# Altium schematic sheet RS232.SchDoc
size A; SheetNumber: 4; SheetTotal: 7
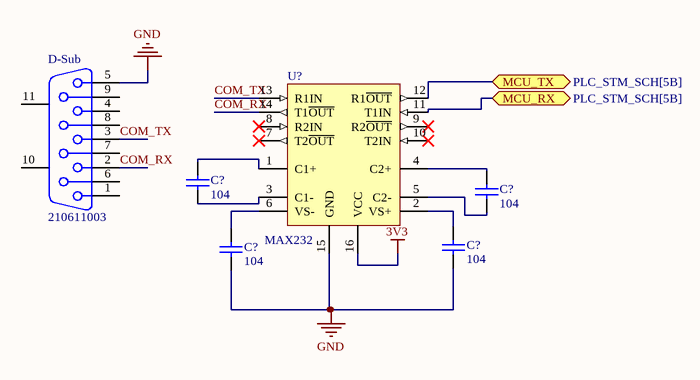
[diagram p0: RS232.SchDoc]

## Parts
(Parts that share a designator on the sheet are numbered #1, #2 ... from top to bottom, then left to right.)
C?#1  104  [tu 0805]
C?#2  104  [tu 0805]
C?#3  104  [tu 0805]
C?#4  104  [tu 0805]
D-Sub  210611003  [COM9B]
U?  MAX232  [SO16]

## Ports
MCU_RX (bidir, see PLC_STM_SCH[5B]), MCU_TX (bidir, see PLC_STM_SCH[5B])

## Nets
3V3: U?.16(VCC)
GND: C?#3.2 C?#4.2 D-Sub.5 U?.15(GND)
COM_RX: D-Sub.2 U?.14(T1~{OUT})
COM_TX: D-Sub.3 U?.13(R1IN)
MCU_RX: U?.11(T1IN) ; port MCU_RX
MCU_TX: U?.12(R1~{OUT}) ; port MCU_TX
NetC?#1_1: C?#1.1 U?.1(C1+)
NetC?#1_2: C?#1.2 U?.3(C1-)
NetC?#2_1: C?#2.1 U?.4(C2+)
NetC?#2_2: C?#2.2 U?.5(C2-)
NetC?#3_1: C?#3.1 U?.2(VS+)
NetC?#4_1: C?#4.1 U?.6(VS-)

Not connected (* = marked no-connect by the designer): D-Sub 1 4 6 7 8 9 10(MH1) 11(MH2); U? 7(T2~{OUT})* 8(R2IN)* 9(R2~{OUT})* 10(T2IN)*

## Library data of the parts
C?#1-C?#4 = Tu 0805 104 50V 10%: Dán; Don_Vi: Con; So_Chan: 2; Ten_Linh_Kien: Tụ 0805 104-100nF 10% 50V; Ma_Hang: MH004551; Chung_Loai: Dán; Kieu_Chan: *
D-Sub = CON 9BD: D-SUB-Filter Connectors WE-DS, Solder Pin Straight; Manufacturer: Würth Elektronik eiSos GmbH; partNo: 210611003; ComponentLink1Description: Manufacturer; ComponentLink1URL: http://www.we-online.de; Created by: Christin Zierenner; Created Date: May 2012; ComponentLink2Description: Datasheet; ComponentLink2URL: http://katalog.we-online.de/kataloge/eisos/index.php?language=en&pf=Filter_gerade
U? = MAX232: RS232 LEVEL SHIFTER; Manufacturer Part Number: MAX232DR; Manufacturer: Texas Instruments; Number of Drivers/Receivers: 2/2; Voltage - Supply: 4.5 V ~ 5.5 V; Supplier 1: Digi-Key; Supplier Part Number 1: 296-14619-1-ND; RoHS: RoHS Compliant; Packaging: Cut Tape (CT); Protocol: RS232; Type: Transceiver; Supplier Part Number: 296-14619-1-ND; Supplier: Digi-Key; Category: Integrated Circuits (ICs); Package / Case: 16-SOIC (3.9mm Width)